# EasyEDA schematic 74HC595_2021-04-18.json
TITLE: Sheet_1; REV: 1.0; Date: 2021-03-12; Sheet: 1/1; Drawn By: Muhammad Mehdi; Company: Your Company
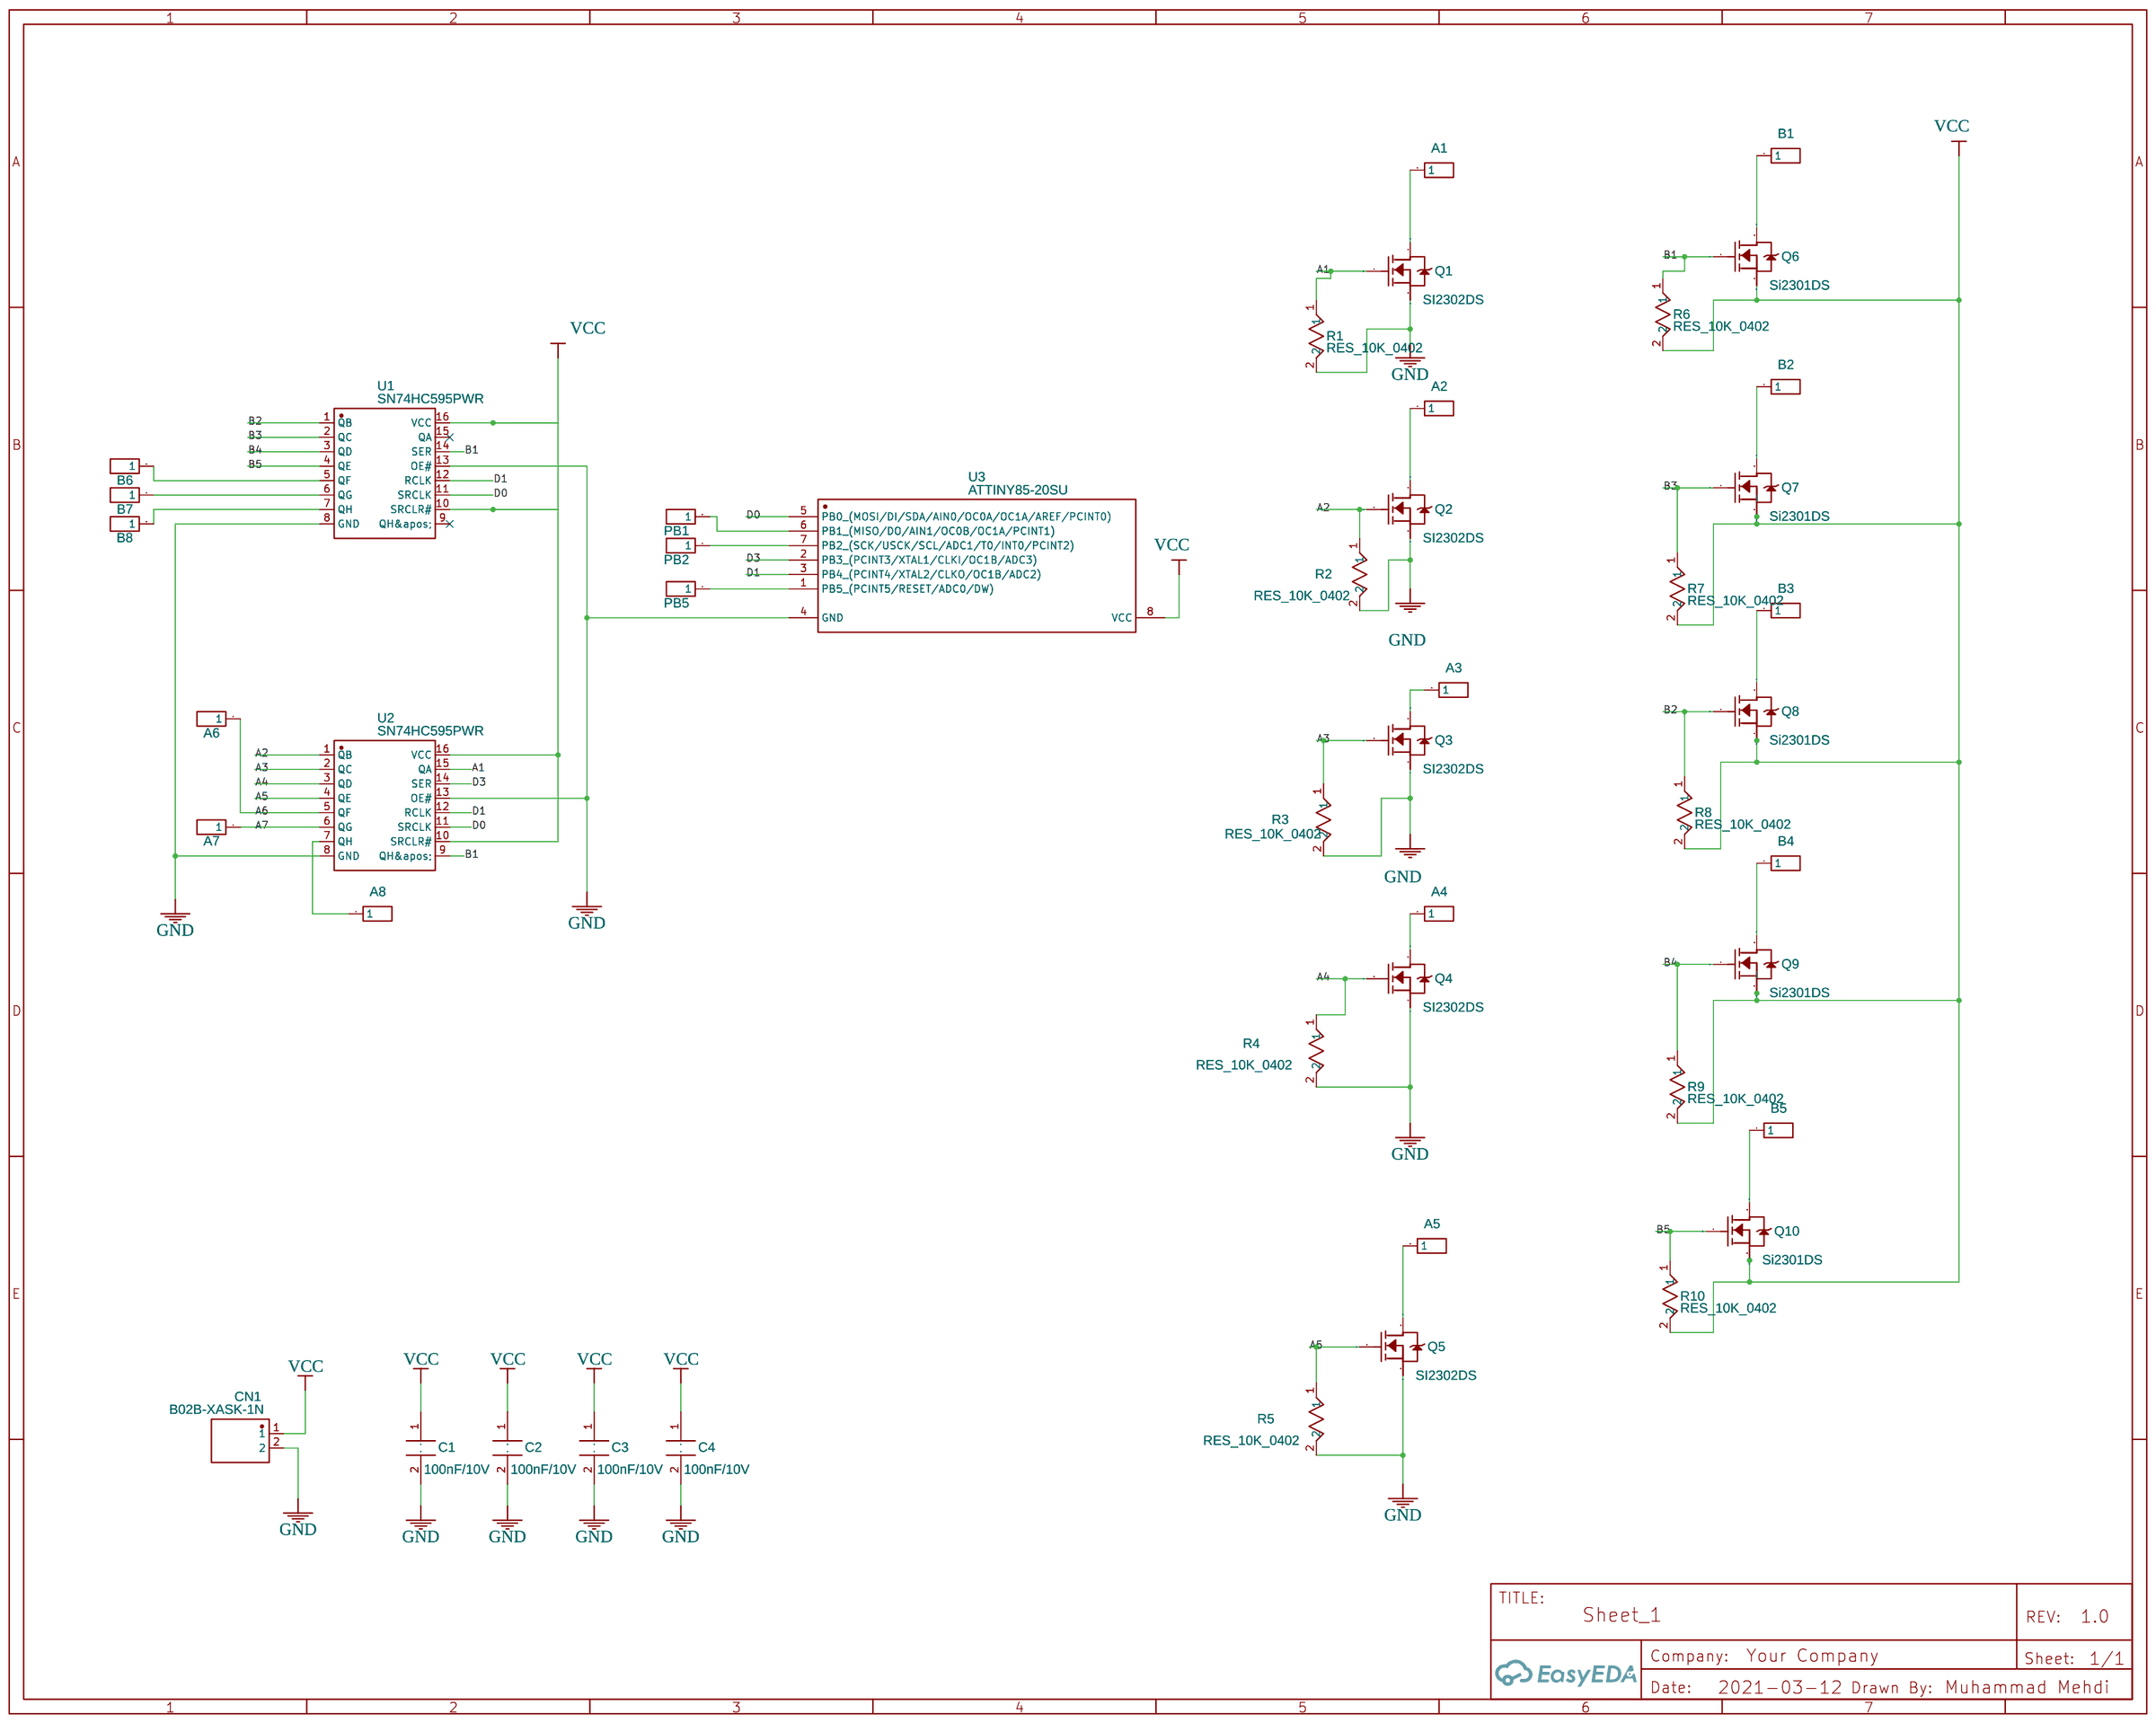
[diagram p0: schematic sheet]

## Parts
A1  1  [1X01-CLEANBIG]
A2  1  [1X01-CLEANBIG]
A3  1  [1X01-CLEANBIG]
A4  1  [1X01-CLEANBIG]
A5  1  [1X01-CLEANBIG]
A6  1  [1X01-CLEANBIG]
A7  1  [1X01-CLEANBIG]
A8  1  [1X01-CLEANBIG]
B1  1  [1X01-CLEANBIG]
B2  1  [1X01-CLEANBIG]
B3  1  [1X01-CLEANBIG]
B4  1  [1X01-CLEANBIG]
B5  1  [1X01-CLEANBIG]
B6  1  [1X01-CLEANBIG]
B7  1  [1X01-CLEANBIG]
B8  1  [1X01-CLEANBIG]
C1  100nF/10V  [C0805]
C2  100nF/10V  [C0805]
C3  100nF/10V  [C0805]
C4  100nF/10V  [C0805]
CN1  B02B-XASK-1N  [CONN-TH_B02B-XASK-1N-LF-SN]
PB1  1  [1X01-CLEANBIG]
PB2  1  [1X01-CLEANBIG]
PB5  1  [1X01-CLEANBIG]
Q1  SI2302DS  [SOT-23-3_L2.9-W1.3-P1.90-LS2.4-BR]
Q2  SI2302DS  [SOT-23-3_L2.9-W1.3-P1.90-LS2.4-BR]
Q3  SI2302DS  [SOT-23-3_L2.9-W1.3-P1.90-LS2.4-BR]
Q4  SI2302DS  [SOT-23-3_L2.9-W1.3-P1.90-LS2.4-BR]
Q5  SI2302DS  [SOT-23-3_L2.9-W1.3-P1.90-LS2.4-BR]
Q6  Si2301DS  [SOT-23-3_L2.9-W1.3-P1.90-LS2.4-BR]
Q7  Si2301DS  [SOT-23-3_L2.9-W1.3-P1.90-LS2.4-BR]
Q8  Si2301DS  [SOT-23-3_L2.9-W1.3-P1.90-LS2.4-BR]
Q9  Si2301DS  [SOT-23-3_L2.9-W1.3-P1.90-LS2.4-BR]
Q10  Si2301DS  [SOT-23-3_L2.9-W1.3-P1.90-LS2.4-BR]
R1  RES_10K_0402  [R0402]
R2  RES_10K_0402  [R0402]
R3  RES_10K_0402  [R0402]
R4  RES_10K_0402  [R0402]
R5  RES_10K_0402  [R0402]
R6  RES_10K_0402  [R0402]
R7  RES_10K_0402  [R0402]
R8  RES_10K_0402  [R0402]
R9  RES_10K_0402  [R0402]
R10  RES_10K_0402  [R0402]
U1  SN74HC595PWR  [TSSOP-16_16PIN-L5.10-W6.60-PITCH0.65-BL]
U2  SN74HC595PWR  [TSSOP-16_16PIN-L5.10-W6.60-PITCH0.65-BL]
U3  ATTINY85-20SU  [DIP-8_L9.7-W6.4-P2.54-LS7.6-BL]

## Library data of the parts
A1-A8 B1-B8 PB1 PB2 PB5 = Header-Male-2.54_1x1: Supplier: LCSC; Manufacturer: ReliaPro; Supplier Part: C81276; LCSC Assembly: Yes; SMT Type: Extend; Assembly Type: manualWeld; Paste Type: expand
C1-C4 = 100 uF 1206 10VDC: Manufacturer: Taiyo; Manufacturer Part: LMK316BBJ107ML-T; Contributor: Luca Mainini
CN1 = B02B-XASK-1N (LF)(SN): Supplier: LCSC; Supplier Part: C160301; Manufacturer: JST Sales America; Contributor: LCSC; LCSC Assembly: Yes; SMT Type: Extend; Assembly Type: manualWeld; Paste Type: expand
Q1-Q10 = SI2302DS-T1-GE3: Supplier: LCSC; Supplier Part: C558245; Manufacturer: VBsemi Elec; Contributor: LCSC; SMT Type: Extend; JLCPCB SMD: Yes; LCSC Assembly: Yes; Assembly Type: smtWeld; Paste Type: expand
R1-R10 = RES_10K_0402: Manufacturer: Walsin; Manufacturer Part: WR04X1002FTL; Contributor: abhinavjain
U1 U2 = SN74HC595PWR: Supplier: LCSC; Supplier Part: C273642; Manufacturer: Texas Instruments; Contributor: cesar tinco pillaca
U3 = ATTINY85-20SU: Supplier: LCSC; Manufacturer: MICROCHIP; Supplier Part: C89852; SMT Type: Extend; JLCPCB SMD: Yes; Assembly Type: smtWeld; Paste Type: recommend

## Nets
GND: C1.2 C2.2 C3.2 C4.2 CN1.2 Q1.2(S) Q2.2(S) Q3.2(S) Q4.2(S) Q5.2(S) R1.2 R2.2 R3.2 R4.2 R5.2 U1.8(GND) U1.13(OE#) U2.8(GND) U2.13(OE#) U3.4(GND)
VCC: C1.1 C2.1 C3.1 C4.1 CN1.1 Q6.2(S) Q7.2(S) Q8.2(S) Q9.2(S) Q10.2(S) R6.2 R7.2 R8.2 R9.2 R10.2 U1.10(SRCLR#) U1.16(VCC) U2.10(SRCLR#) U2.16(VCC) U3.8(VCC)
A1: Q1.1(G) R1.1 U2.15(QA)
A2: Q2.1(G) R2.1 U2.1(QB)
A3: Q3.1(G) R3.1 U2.2(QC)
A4: Q4.1(G) R4.1 U2.3(QD)
A5: Q5.1(G) R5.1 U2.4(QE)
A6: A6.1 U2.5(QF)
A7: A7.1 U2.6(QG)
B1: Q6.1(G) R6.1 U1.14(SER) U2.9(QH')
B2: Q8.1(G) R8.1 U1.1(QB)
B3: Q7.1(G) R7.1 U1.2(QC)
B4: Q9.1(G) R9.1 U1.3(QD)
B5: Q10.1(G) R10.1 U1.4(QE)
D0: U1.11(SRCLK) U2.11(SRCLK) U3.5(PB0 (MOSI/DI/SDA/AIN0/OC0A/OC1A/AREF/PCINT0))
D1: U1.12(RCLK) U2.12(RCLK) U3.3(PB4 (PCINT4/XTAL2/CLKO/OC1B/ADC2))
D3: U2.14(SER) U3.2(PB3 (PCINT3/XTAL1/CLKI/OC1B/ADC3))
Net-(A1-1): A1.1 Q1.3(D)
Net-(A2-1): A2.1 Q2.3(D)
Net-(A3-1): A3.1 Q3.3(D)
Net-(A4-1): A4.1 Q4.3(D)
Net-(A5-1): A5.1 Q5.3(D)
Net-(A8-1): A8.1 U2.7(QH)
Net-(B1-1): B1.1 Q6.3(D)
Net-(B2-1): B2.1 Q7.3(D)
Net-(B3-1): B3.1 Q8.3(D)
Net-(B4-1): B4.1 Q9.3(D)
Net-(B5-1): B5.1 Q10.3(D)
Net-(B6-1): B6.1 U1.5(QF)
Net-(B7-1): B7.1 U1.6(QG)
Net-(B8-1): B8.1 U1.7(QH)
Net-(PB1-1): PB1.1 U3.6(PB1 (MISO/DO/AIN1/OC0B/OC1A/PCINT1))
Net-(PB2-1): PB2.1 U3.7(PB2 (SCK/USCK/SCL/ADC1/T0/INT0/PCINT2))
Net-(PB5-1): PB5.1 U3.1(PB5 (PCINT5/RESET/ADC0/DW))

Not connected (* = marked no-connect by the designer): U1 9(QH')* 15(QA)*
